# Altium schematic sheet JTAG interfaces.SchDoc
size A4; SheetNumber: 10; SheetTotal: 10
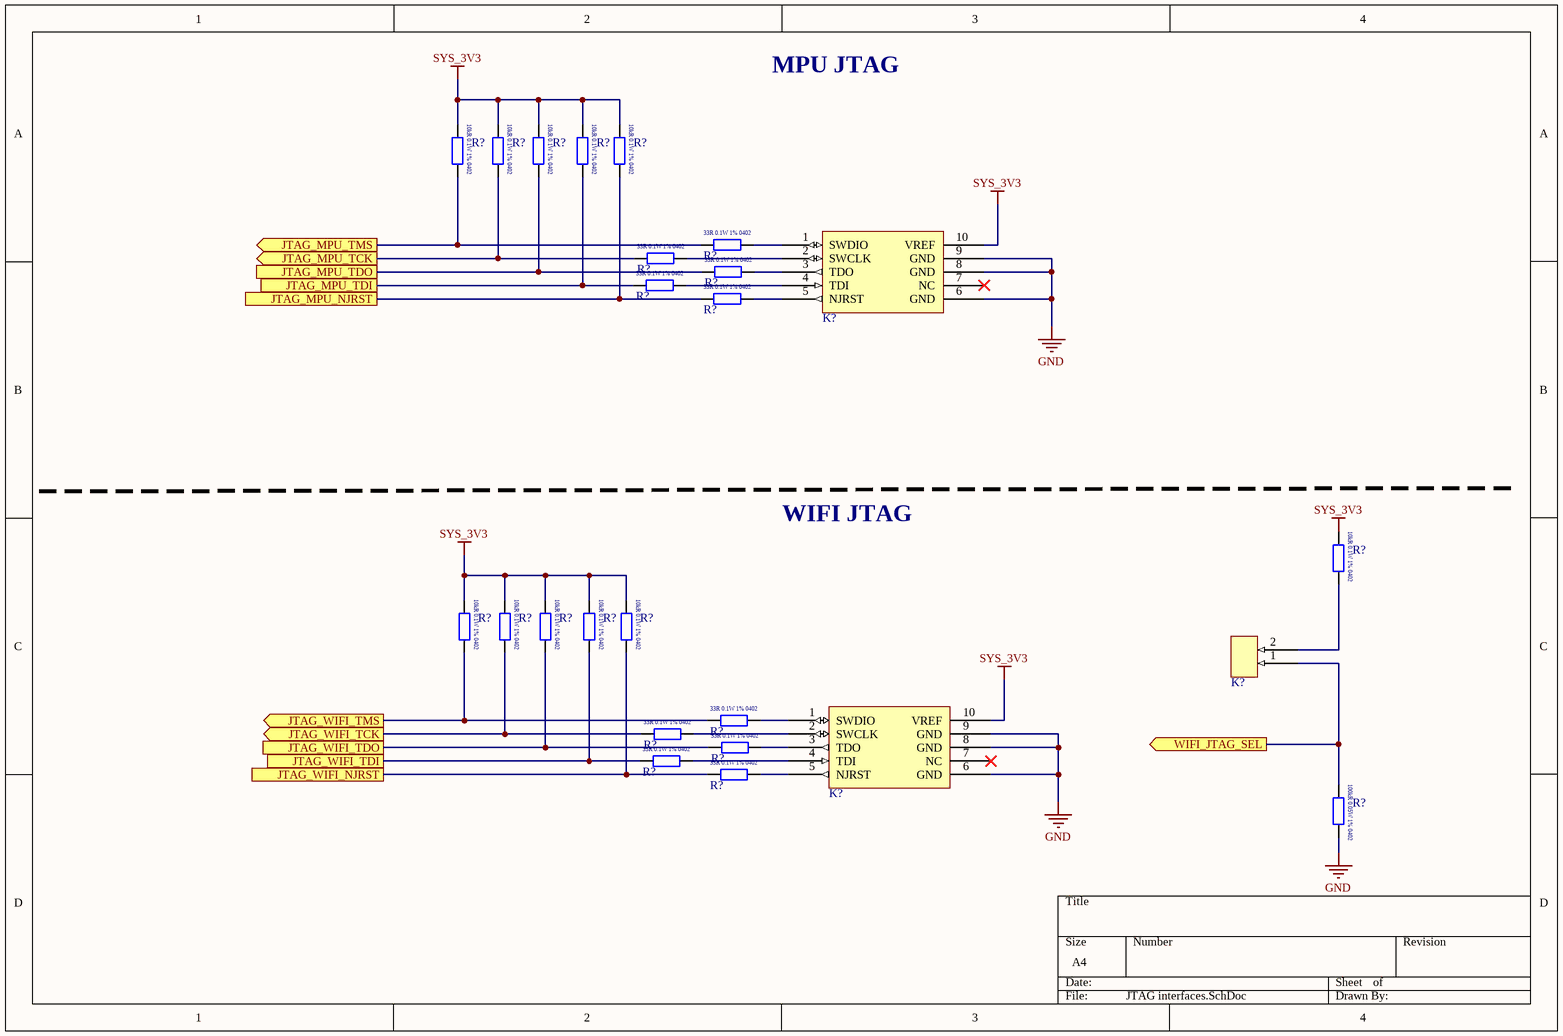
[diagram p0: JTAG interfaces.SchDoc]

## Parts
(Parts that share a designator on the sheet are numbered #1, #2 ... from top to bottom, then left to right.)
K?#1  20021521-00010T1LF  [AMPHENOL_20021521-00010T1LF]  (value not drawn)
K?#2  TSW-102-07-F-S  [SAMTEC_TSW-102-07-F-S]  (value not drawn)
K?#3  20021521-00010T1LF  [AMPHENOL_20021521-00010T1LF]  (value not drawn)
R?#1  RK73H1ETTP1002F  [RESC1005X04N]  (value not drawn)
R?#2  RK73H1ETTP1002F  [RESC1005X04N]  (value not drawn)
R?#3  RK73H1ETTP1002F  [RESC1005X04N]  (value not drawn)
R?#4  RK73H1ETTP1002F  [RESC1005X04N]  (value not drawn)
R?#5  RK73H1ETTP1002F  [RESC1005X04N]  (value not drawn)
R?#6  ERJ-2RKF33R0X  [RESC1005X04L]  (value not drawn)
R?#7  ERJ-2RKF33R0X  [RESC1005X04L]  (value not drawn)
R?#8  ERJ-2RKF33R0X  [RESC1005X04L]  (value not drawn)
R?#9  ERJ-2RKF33R0X  [RESC1005X04L]  (value not drawn)
R?#10  ERJ-2RKF33R0X  [RESC1005X04L]  (value not drawn)
R?#11  RK73H1ETTP1002F  [RESC1005X04N]  (value not drawn)
R?#12  RK73H1ETTP1002F  [RESC1005X04N]  (value not drawn)
R?#13  RK73H1ETTP1002F  [RESC1005X04N]  (value not drawn)
R?#14  RK73H1ETTP1002F  [RESC1005X04N]  (value not drawn)
R?#15  RK73H1ETTP1002F  [RESC1005X04N]  (value not drawn)
R?#16  RK73H1ETTP1002F  [RESC1005X04N]  (value not drawn)
R?#17  ERJ-2RKF33R0X  [RESC1005X04L]  (value not drawn)
R?#18  ERJ-2RKF33R0X  [RESC1005X04L]  (value not drawn)
R?#19  ERJ-2RKF33R0X  [RESC1005X04L]  (value not drawn)
R?#20  ERJ-2RKF33R0X  [RESC1005X04L]  (value not drawn)
R?#21  ERJ-2RKF33R0X  [RESC1005X04L]  (value not drawn)
R?#22  RK73H1ETTP1003F  [RESC1005X04N]  (value not drawn)

## Ports
JTAG_MPU_NJRST, JTAG_MPU_TCK (out), JTAG_MPU_TDI, JTAG_MPU_TDO, JTAG_MPU_TMS (out), JTAG_WIFI_NJRST, JTAG_WIFI_TCK (out), JTAG_WIFI_TDI, JTAG_WIFI_TDO, JTAG_WIFI_TMS (out), WIFI_JTAG_SEL (out)

## Nets
GND: K?#1.6(GND) K?#1.8(GND) K?#1.9(GND) K?#3.6(GND) K?#3.8(GND) K?#3.9(GND) R?#22.2
SYS_3V3: K?#1.10(VREF) K?#3.10(VREF) R?#1.1 R?#2.1 R?#3.1 R?#4.1 R?#5.1 R?#11.1 R?#12.1 R?#13.1 R?#14.1 R?#15.1 R?#16.1
JTAG_MPU_NJRST: R?#5.2 R?#10.1 ; port JTAG_MPU_NJRST
JTAG_MPU_TCK: R?#2.2 R?#7.1 ; port JTAG_MPU_TCK
JTAG_MPU_TDI: R?#4.2 R?#9.1 ; port JTAG_MPU_TDI
JTAG_MPU_TDO: R?#3.2 R?#8.1 ; port JTAG_MPU_TDO
JTAG_MPU_TMS: R?#1.2 R?#6.1 ; port JTAG_MPU_TMS
JTAG_WIFI_NJRST: R?#16.2 R?#21.1 ; port JTAG_WIFI_NJRST
JTAG_WIFI_TCK: R?#13.2 R?#18.1 ; port JTAG_WIFI_TCK
JTAG_WIFI_TDI: R?#15.2 R?#20.1 ; port JTAG_WIFI_TDI
JTAG_WIFI_TDO: R?#14.2 R?#19.1 ; port JTAG_WIFI_TDO
JTAG_WIFI_TMS: R?#12.2 R?#17.1 ; port JTAG_WIFI_TMS
WIFI_JTAG_SEL: K?#2.1 R?#22.1 ; port WIFI_JTAG_SEL
NetK?#1_1: K?#1.1(SWDIO) R?#6.2
NetK?#1_2: K?#1.2(SWCLK) R?#7.2
NetK?#1_3: K?#1.3(TDO) R?#8.2
NetK?#1_4: K?#1.4(TDI) R?#9.2
NetK?#1_5: K?#1.5(NJRST) R?#10.2
NetK?#2_2: K?#2.2 R?#11.2
NetK?#3_1: K?#3.1(SWDIO) R?#17.2
NetK?#3_2: K?#3.2(SWCLK) R?#18.2
NetK?#3_3: K?#3.3(TDO) R?#19.2
NetK?#3_4: K?#3.4(TDI) R?#20.2
NetK?#3_5: K?#3.5(NJRST) R?#21.2

Not connected (* = marked no-connect by the designer): K?#1 7(NC)*; K?#3 7(NC)*

## Notes on the sheet
- MPU JTAG
- WIFI JTAG
- (in symbol ERJ-2RKF33R0X) 33R 0.1W 1% 0402
- (in symbol RK73H1ETTP1002F) 10kR 0.1W 1% 0402
- (in symbol RK73H1ETTP1003F) 100kR 0.05W 1% 0402

## Library data of the parts
K?#1 K?#3 = 20021521-00010T1LF: Connector Header Surface Mount 10 position 0.050" (1.27mm)
K?#2 = TSW-102-07-F-S: Connector Header Through Hole 2 position 0.100" (2.54mm)
R?#1-R?#5 R?#11-R?#16 = RK73H1ETTP1002F: 10 kOhms ±1% 0.1W, 1/10W Chip Resistor 0402 (1005 Metric) Automotive AEC-Q200 Thick Film
R?#6-R?#10 R?#17-R?#21 = ERJ-2RKF33R0X: 33 Ohms ±1% 0.1W, 1/10W Chip Resistor 0402 (1005 Metric) Automotive AEC-Q200 Thick Film
R?#22 = RK73H1ETTP1003F: 100 kOhms ±1% 0.1W, 1/10W Chip Resistor 0402 (1005 Metric) Automotive AEC-Q200 Thick Film